# Altium schematic sheet isoSPI.SchDoc
size A4
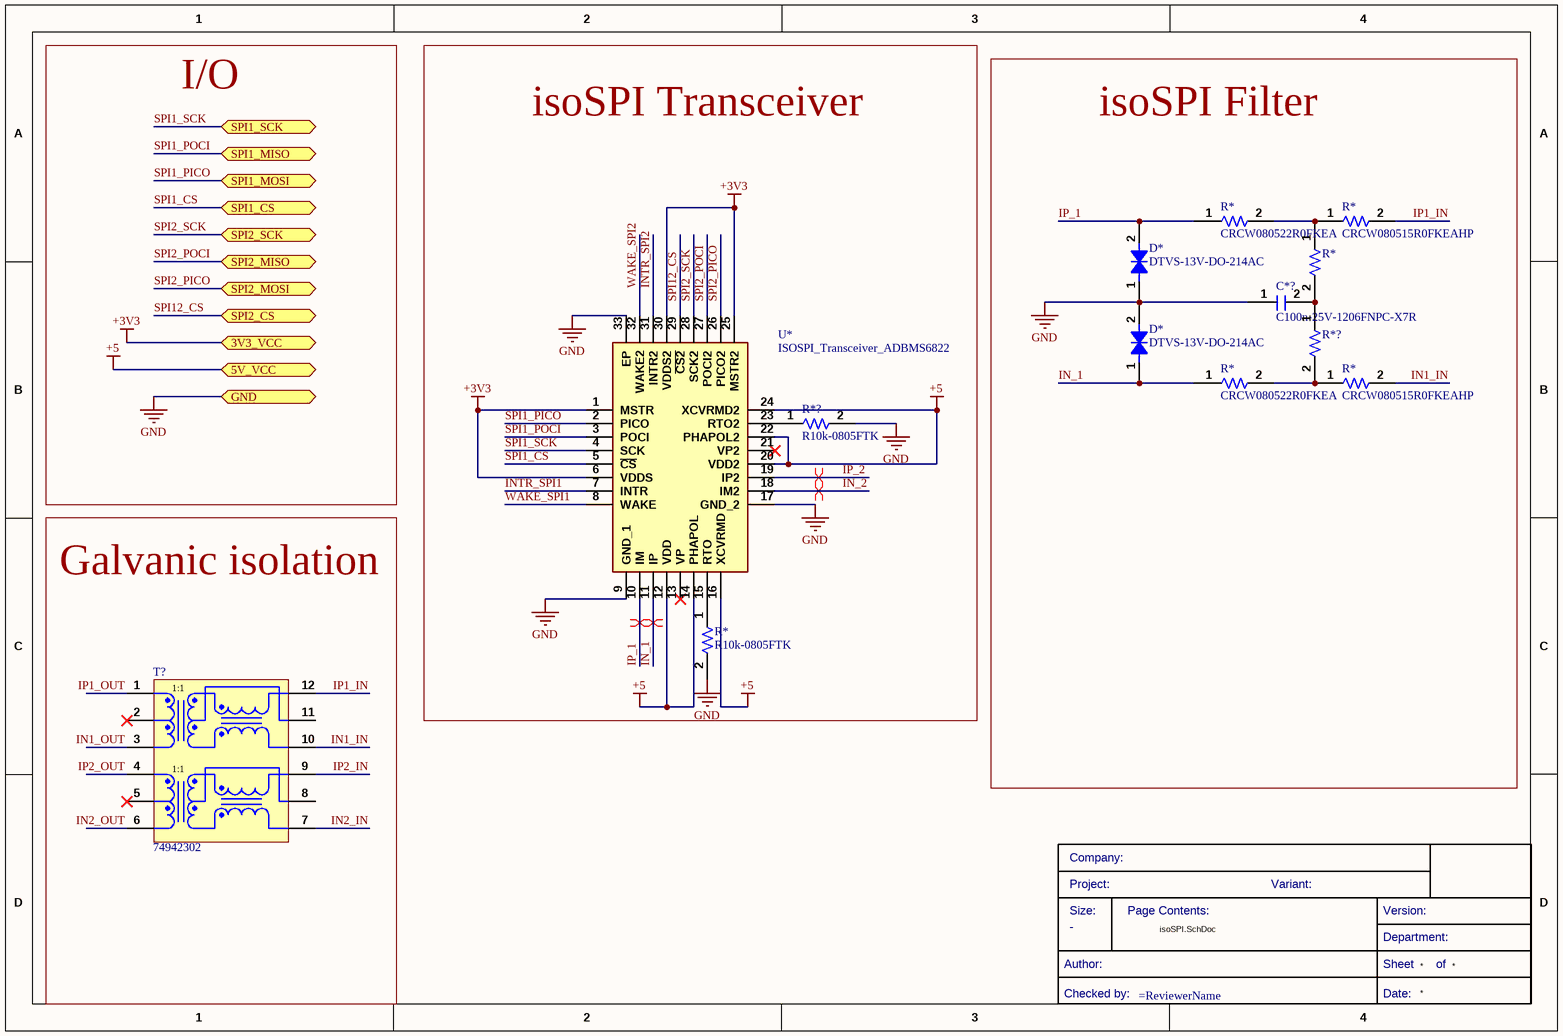
[diagram p0: isoSPI.SchDoc]

## Parts
(Parts that share a designator on the sheet are numbered #1, #2 ... from top to bottom, then left to right.)
?  (no value)  (graphical)
C*?  C100n-25V-1206FNPC-X7R  [C1206FNPC-RW]
D*#1  DTVS-13V-DO-214AC  [DTVS-DO-214AC]
D*#2  DTVS-13V-DO-214AC  [DTVS-DO-214AC]
R*#1  CRCW080522R0FKEA  [0805]
R*#2  CRCW080543R2FKEA  [FP-CRCW0805-e3-IPC_A]  (value not drawn)
R*#3  CRCW080515R0FKEAHP  [FP-CRCW0805-HPe3-IPC_B]
R*#4  CRCW080522R0FKEA  [0805]
R*#5  CRCW080515R0FKEAHP  [FP-CRCW0805-HPe3-IPC_B]
R*#6  R10k-0805FTK  [R0805FTK]
R*?#1  CRCW080543R2FKEA  [FP-CRCW0805-e3-IPC_A]  (value not drawn)
R*?#2  R10k-0805FTK  [R0805FTK]
T?  74942302  [WE-BMS_74942302]
U*  ISOSPI_Transceiver_ADBMS6822  [ISOSPI_Transceiver_ADBMS6822]

## Blocks framed on the sheet
isoSPI Transceiver: R*#6 R*?#2 U*
isoSPI Filter: C*? D*#1 D*#2 R*#1-R*#5 R*?#1
Galvanic isolation: T?

## Ports
3V3_VCC (bidir, see Master_uC_PCB.SchDoc[2B]), 5V_VCC (bidir, see Master_uC_PCB.SchDoc[2B]), GND (bidir, see Master_uC_PCB.SchDoc[2B]), SPI1_CS (bidir, see Master_uC_PCB.SchDoc[2B]), SPI1_MISO (bidir, see Master_uC_PCB.SchDoc[2B]), SPI1_MOSI (bidir, see Master_uC_PCB.SchDoc[2B]), SPI1_SCK (bidir, see Master_uC_PCB.SchDoc[2B]), SPI2_CS (bidir, see Master_uC_PCB.SchDoc[2B]), SPI2_MISO (bidir, see Master_uC_PCB.SchDoc[2B]), SPI2_MOSI (bidir, see Master_uC_PCB.SchDoc[2B]), SPI2_SCK (bidir, see Master_uC_PCB.SchDoc[2B])

## Nets
+3V3: U*.1(MSTR) U*.6(VDDS) U*.25(MSTR2) U*.30(VDDS2) ; port 3V3_VCC
+5: U*.12(VDD) U*.14(PHAPOL) U*.16(XCVRMD) U*.20(VDD2) U*.22(PHAPOL2) U*.24(XCVRMD2) ; port 5V_VCC
GND: C*?.1 D*#1.1 D*#2.2 R*#6.2 R*?#2.2 U*.9(GND_1) U*.17(GND_2) U*.33(EP) ; port GND
IN1_IN: R*#5.2 T?.10
IN1_OUT: T?.3
IN2_IN: T?.7
IN2_OUT: T?.6
IN_1: D*#2.1 R*#4.1 U*.11(IP)
IN_2: U*.18(IM2)
INTR_SPI1: U*.7(INTR)
INTR_SPI2: U*.31(INTR2)
IP1_IN: R*#3.2 T?.12
IP1_OUT: T?.1
IP2_IN: T?.9
IP2_OUT: T?.4
IP_1: D*#1.2 R*#1.1 U*.10(IM)
IP_2: U*.19(IP2)
SPI1_CS: U*.5(~{CS}) ; port SPI1_CS
SPI1_PICO: U*.2(PICO) ; port SPI1_MOSI
SPI1_POCI: U*.3(POCI) ; port SPI1_MISO
SPI1_SCK: U*.4(SCK) ; port SPI1_SCK
SPI2_PICO: U*.26(PICO2) ; port SPI2_MOSI
SPI2_POCI: U*.27(POCI2) ; port SPI2_MISO
SPI2_SCK: U*.28(SCK2) ; port SPI2_SCK
SPI12_CS: U*.29(~{CS2}) ; port SPI2_CS
WAKE_SPI1: U*.8(WAKE)
WAKE_SPI2: U*.32(WAKE2)
NetC*?_2: C*?.2 R*#2.2 R*?#1.1
NetR*#1_2: R*#1.2 R*#2.1 R*#3.1
NetR*#4_2: R*#4.2 R*#5.1 R*?#1.2
NetR*#6_1: R*#6.1 U*.15(RTO)
NetR*?#2_1: R*?#2.1 U*.23(RTO2)

Not connected (* = marked no-connect by the designer): T? 2* 5* 8 11; U* 13(VP)* 21(VP2)*

## Layout directives
differential pair: IN_1, IN_2, IP_1, IP_2

## Notes on the sheet
- I/O
- Size:
- Company:
- Project:
- Page Contents:
- Variant:
- Version:
- Checked by:
- Author:
- Sheet
- Date:
- Department:
- of
- (in symbol CMP-00198-1) 1:1

## Library data of the parts
? = CMP-00043-6: Standard Title Block
C*? = CMP-00062-1: Cap Cer 0.1UF 25V X7R 1206; Manufacturer Part Number: 885012208058; Manufacturer: Wurth Electronics; .Creator: DO; Tolerance: 10%; Value: 100nF; Voltage Rating: 25V; RoHS Compliant: Yes; ComponentLink2URL: https://www.we-online.com/catalog/en/WCAP-CSGP-25VDC#885012208058; ComponentLink1Description: Datasheet; RoHS: Yes; Stock 1: 4375; Thickness: 0.035inch; ComponentLink1URL: https://www.we-online.com/catalog/datasheet/885012208058.pdf; Min Operating Temperature: -55°C; Case/Package: 1206; Source: Passives.SchLib; Width: 0.063inch; Packaging: Tape and Reel; Pricing 1: 1=0,11000, 10=0,10100, 100=0,09100, 500=0,08000 (USD); ComponentLink2Description: Where buy it; Length: 0.126inch; ComponentLink3URL: https://katalog.we-online.de/pbs/datasheet/885012208058.pdf?src-supplier=Digi-Key; Case Code (Metric): 3216; Max Operating Temperature: 125°C; Category: Capacitor; ComponentLink3Description: https://katalog.we-online.de/pbs/datasheet/885012208058.pdf?src-supplier=Digi-Key; Mount: Surface Mount; Design Item ID: C100n-25V-1206FNPC-X7R
D*#1 D*#2 = CMP-00155-1: Tvs Diode, 400W, 13V, Bidir, DO-214AC; Manufacturer Part Number: 824501131; Manufacturer: Wurth Electronics; Peak Pulse Current: 18.6A; Power Line Protection: No; .Creator: DO; Forward Voltage: 15.15V; Polarity: Bidirectional; Number of Bidirectional Channels: 1; Clamping Voltage: 21.5V; Max Operating Temperature: 150°C; Category: TVS Diodes; Stock 1: 1000; RoHS: Yes; ComponentLink3Description: Where buy it; Source: Filter components.SchLib; Design Item ID: DTVS-13V-DO-214AC; REACH SVHC: Unknown; Min Operating Temperature: -65°C; Resistor Type: Zener; ComponentLink2Description: http://www.farnell.com/datasheets/2036399.pdf?src-supplier=Element14; Peak Pulse Power: 400W; ComponentLink1URL: https://katalog.we-online.de/pbs/datasheet/824501131.pdf?src-supplier=Digi-Key; Packaging: Cut Tape; ComponentLink2URL: http://www.farnell.com/datasheets/2036399.pdf?src-supplier=Element14; ComponentLink3URL: https://www.we-online.com/catalog/en/WE-TVSP?sq=824501131#824501131; RoHS Compliant: Yes; Reverse Standoff Voltage: 13V; Mount: Surface Mount; Min Breakdown Voltage: 15.15V; ComponentLink1Description: https://katalog.we-online.de/pbs/datasheet/824501131.pdf?src-supplier=Digi-Key; Pricing 1: 1=0,27000 (USD); Pins: 2
R*#1 R*#4 = CMP-009-00017-2: CRCW0805 Resistor T/R 0.125W,1%,22R Vishay CRCW Series Thick Film Surface Mount Resistor 0805 Case 22 +/-1% 0.125W +/-100ppm/C; Geometry.Height: 0.5mm; Manufacturer_Part_Number: CRCW080522R0FKEA; Source: CRCW080522R0FKEA.SchLib; Mouser Part Number: 71-CRCW0805-22-E3; Design Item ID: CRCW080522R0FKEA; Arrow Price/Stock: https://www.arrow.com/en/products/crcw080522r0fkea/vishay; Datasheet Link: http://www.vishay.com/docs/20035/dcrcwe3.pdf; Mouser Price/Stock: https://www.mouser.co.uk/ProductDetail/Vishay-Dale/CRCW080522R0FKEA?qs=fIsz7OpyEY9aZZAJSCbWBw%3D%3D; Manufacturer_Name: Vishay; Arrow Part Number: CRCW080522R0FKEA
R*#2 R*?#1 = CMP-009-00016-1: Fixed Resistor, Metal Glaze/thick Film, 0.125W, 43.2ohm, 150V, 1% +/-Tol, 100ppm/Cel, Surface Mount, 0805; Value: 43.2; Power: 125mW; RoHS Compliant: Yes; Mounting Technology: Surface Mount; Tolerance: 1%; Max Operating Temperature: 155°C; Case/Package: 0805; Min Operating Temperature: -55°C; Pins: 2
R*#3 R*#5 = CMP-009-00012-1: Fixed Resistor, Metal Glaze/thick Film, 0.5W, 15ohm, 150V, 1% +/-Tol, 100ppm/Cel, Surface Mount, 0805; Value: 15; Power: 500mW; Tolerance: 1%; Pins: 2; Mounting Technology: Surface Mount; Case/Package: 0805; Max Operating Temperature: 155°C; Min Operating Temperature: -55°C; RoHS Compliant: Yes
R*#6 R*?#2 = CMP-00085-1: BOURNS         CR0805-JW-103ELF            Surface Mount Chip Resistor, Thick Film, CR Series, 10 kohm, 125 mW,  5%, 150 V; .Creator: DR; Power Rating: 125mW; Voltage Rating (DC): 100V; Voltage Rating: 150V; Temperature Coefficient: 200ppm/°C; Value: 10k; ComponentLink6URL: https://datasheet.ciiva.com/16783/70154685-16783482.pdf?src-supplier=Allied+Electronics; Manufacturer 1: Bourns; Package Quantity: 1; ComponentLink10URL: https://datasheet.ciiva.com/7985/1856384-7985869.pdf?src-supplier=Element14; Technology: THICK FILM; Source: Passives.SchLib; RoHS Compliant: Yes; ComponentLink10Description: https://datasheet.ciiva.com/7985/1856384-7985869.pdf?src-supplier=Element14; ComponentLink1URL: https://datasheet.ciiva.com/11821/0900766b80fcdb72-11821135.pdf?src-supplier=RSComponents; ComponentLink7Description: https://datasheet.ciiva.com/5548/chpreztr-5548491.pdf?src-supplier=Mouser; Radiation Hardening: No; Design Item ID: R10k-0805FTK; ComponentLink4Description: https://datasheet.ciiva.com/7986/691949-7986187.pdf?src-supplier=Element14; Pins: 2; ComponentLink9URL: https://datasheet.ciiva.com/6559/chpreztr-6559901.pdf?src-supplier=Digi-Key; Resistor Type: Thick Film; ComponentLink4URL: https://datasheet.ciiva.com/7986/691949-7986187.pdf?src-supplier=Element14; Contact Plating: Tin; Case Code (Metric): 2012; Military Standard: Not; Depth: 1.25mm; Case/Package: 0805; Packaging: Tape and Reel; ComponentLink9Description: https://datasheet.ciiva.com/6559/chpreztr-6559901.pdf?src-supplier=Digi-Key; Construction: Rectangular; Pricing 1: 1=0,05790, 10=0,01540, 25=0,01340, 100=0,00340 (USD); ComponentLink7URL: https://datasheet.ciiva.com/5548/chpreztr-5548491.pdf?src-supplier=Mouser; Category: Chip SMD Resistors; Length: 2mm; Max Operating Temperature: 155°C; Resistance Tolerance: 5%; Manufacturer Part Number 1: CR0805-JW-103ELF; Height: 0.5mm; ComponentLink2URL: https://datasheet.ciiva.com/9122/chpreztr-9122374.pdf?src-supplier=Avnet; Thickness: 508um; Max Power Dissipation: 125mW; ComponentLink8Description: https://datasheet.ciiva.com/6559/chpreztr-6559900.pdf?src-supplier=Digi-Key; REACH SVHC: No SVHC; ComponentLink8URL: https://datasheet.ciiva.com/6559/chpreztr-6559900.pdf?src-supplier=Digi-Key; ComponentLink5URL: https://datasheet.ciiva.com/30065/159chpreztr-30065976.pdf?src-supplier=Onlinecomponents.com; Width: 1.25mm; ComponentLink11URL: https://datasheet.ciiva.com/48692/001055517-da-01-en-smd-wid-cr0805-jw-103elf-10k-ohm-1-8w-48692118.pdf?src-supplier=Conrad; ComponentLink3Description: https://datasheet.ciiva.com/22693/1902866-22693254.pdf?src-supplier=Element14; ComponentLink11Description: https://datasheet.ciiva.com/48692/001055517-da-01-en-smd-wid-cr0805-jw-103elf-10k-ohm-1-8w-48692118.pdf?src-supplier=Conrad; ComponentLink1Description: https://datasheet.ciiva.com/11821/0900766b80fcdb72-11821135.pdf?src-supplier=RSComponents; ComponentLink2Description: https://datasheet.ciiva.com/9122/chpreztr-9122374.pdf?src-supplier=Avnet; Stock 1: 57566; Min Operating Temperature: -55°C; Series: CR0805; Number of Terminations: 2; Termination: SMD/SMT; Tolerance: 5%; Mount: Surface Mount; ComponentLink6Description: https://datasheet.ciiva.com/16783/70154685-16783482.pdf?src-supplier=Allied+Electronics; ComponentLink5Description: https://datasheet.ciiva.com/30065/159chpreztr-30065976.pdf?src-supplier=Onlinecomponents.com; RoHS: Yes; Features: Moisture Resistant; ComponentLink3URL: https://datasheet.ciiva.com/22693/1902866-22693254.pdf?src-supplier=Element14
T? = CMP-00198-1: WE-BMS SMT transformer -40°C to +125°C
U* = CMP-015-00003-1: The ADBMS6821 (single) and ADBMS6822 (dual) provide bidirectional isolated serial port interface (isoSPI™)...